# Altium project Project.PrjPcb
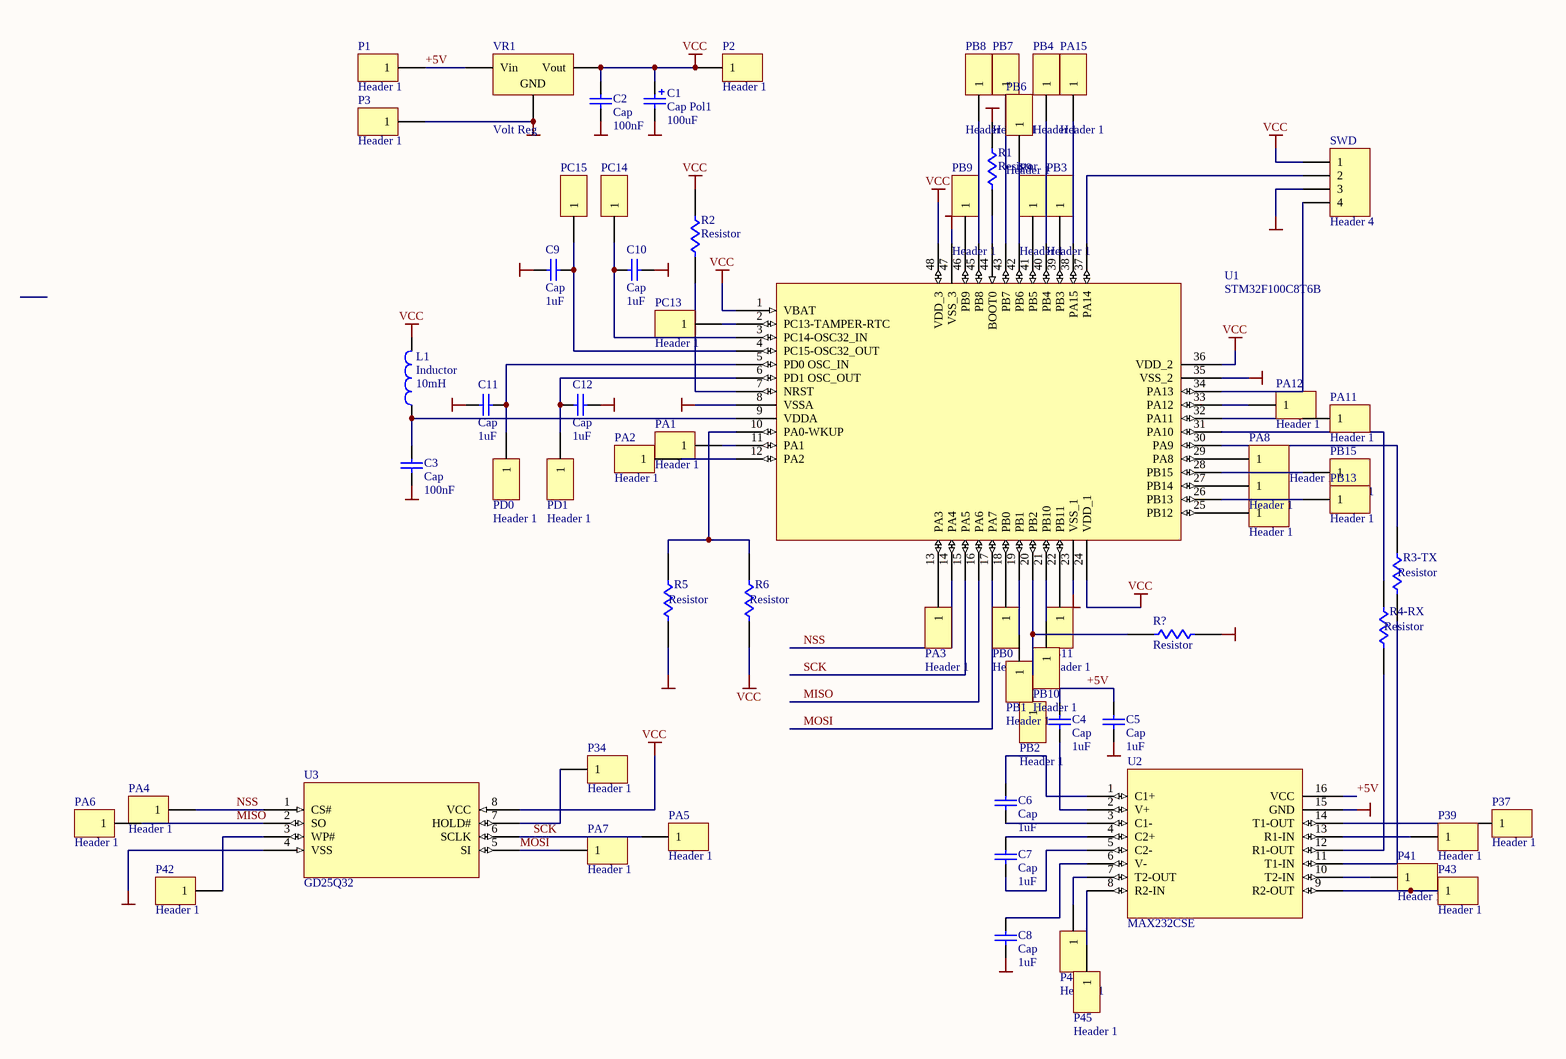
[diagram p0: Sheet1.SchDoc]
1 sheet, 68 parts. Net scope: global (net labels, ports and power ports of the same name join across sheets).
Board file: PCB1.PcbDoc

## Sheet Sheet1.SchDoc
size A3; PageSetup: Record=PageOptions|CenterHorizontal=True|CenterVertical=True|PrintScale=1.00|XCorrection=1.00|YCorrection=1.00|PrintKind=1|BorderSize=5000000|LeftOffset=0|BottomOffset=0|Orientation=2|PaperLength=1000|PaperWidth=1000|Scale=100|PaperSource=7|PrintQuality=-4|MediaType=1|DitherType=10|PaperKind=A2 420 x 594 мм|PrintScaleMode=1

### Parts
C1  Cap Pol1  value 100uF  [RAD-0.3]
C2  Cap  value 100nF  [6-0805_M]
C3  Cap  value 100nF  [6-0805_M]
C4  Cap  value 1uF  [6-0805_M]
C5  Cap  value 1uF  [6-0805_M]
C6  Cap  value 1uF  [6-0805_M]
C7  Cap  value 1uF  [6-0805_M]
C8  Cap  value 1uF  [6-0805_M]
C9  Cap  value 1uF  [6-0805_M]
C10  Cap  value 1uF  [6-0805_M]
C11  Cap  value 1uF  [6-0805_M]
C12  Cap  value 1uF  [6-0805_M]
L1  Inductor  value 10mH  [INDC4532]
P1  Header 1  [PIN1-SMALL]
P2  Header 1  [PIN1-SMALL]
P3  Header 1  [PIN1-SMALL]
P9  Header 1  [PIN1-SMALL]
P34  Header 1  [PIN1-SMALL]
P37  Header 1  [PIN1-SMALL]
P39  Header 1  [PIN1-SMALL]
P41  Header 1  [PIN1-SMALL]
P42  Header 1  [PIN1-SMALL]
P43  Header 1  [PIN1-SMALL]
P44  Header 1  [PIN1-SMALL]
P45  Header 1  [PIN1-SMALL]
PA1  Header 1  [PIN1-SMALL]
PA2  Header 1  [PIN1-SMALL]
PA3  Header 1  [PIN1-SMALL]
PA4  Header 1  [PIN1-SMALL]
PA5  Header 1  [PIN1-SMALL]
PA6  Header 1  [PIN1-SMALL]
PA7  Header 1  [PIN1-SMALL]
PA8  Header 1  [PIN1-SMALL]
PA11  Header 1  [PIN1-SMALL]
PA12  Header 1  [PIN1-SMALL]
PA15  Header 1  [PIN1-SMALL]
PB0  Header 1  [PIN1-SMALL]
PB1  Header 1  [PIN1-SMALL]
PB2  Header 1  [PIN1-SMALL]
PB3  Header 1  [PIN1-SMALL]
PB4  Header 1  [PIN1-SMALL]
PB6  Header 1  [PIN1-SMALL]
PB7  Header 1  [PIN1-SMALL]
PB8  Header 1  [PIN1-SMALL]
PB9  Header 1  [PIN1-SMALL]
PB10  Header 1  [PIN1-SMALL]
PB11  Header 1  [PIN1-SMALL]
PB12  Header 1  [PIN1-SMALL]
PB13  Header 1  [PIN1-SMALL]
PB14  Header 1  [PIN1-SMALL]
PB15  Header 1  [PIN1-SMALL]
PC13  Header 1  [PIN1-SMALL]
PC14  Header 1  [PIN1-SMALL]  (value not drawn)
PC15  Header 1  [PIN1-SMALL]  (value not drawn)
PD0  Header 1  [PIN1-SMALL]
PD1  Header 1  [PIN1-SMALL]
R1  Resistor  [6-0805_M]
R2  Resistor  [6-0805_M]
R3-TX  Resistor  [6-0805_M]
R4-RX  Resistor  [6-0805_M]
R5  Resistor  [6-0805_M]
R6  Resistor  [6-0805_M]
R?  Resistor  [6-0805_M]
SWD  Header 4  [HDR1X4]
U1  STM32F100C8T6B  [TQFP48_L]
U2  MAX232CSE  [NSO16_N]
U3  GD25Q32  [SO8_M]
VR1  Volt Reg  [DPAK]

### Nets
GND: C1.2 C2.1 C3.1 C5.1 C8.1 C9.2 C10.1 C11.2 C12.1 P3.1 R1.1 R5.2 R?.2 SWD.3 U1.8(VSSA) U1.23(VSS_1) U1.35(VSS_2) U1.47(VSS_3) U2.15(GND) U3.4(VSS) VR1.2(GND)
VCC: C1.1 C2.2 L1.2 P2.1 R2.1 R6.2 SWD.1 U1.1(VBAT) U1.24(VDD_1) U1.36(VDD_2) U1.48(VDD_3) U3.8(VCC) VR1.3(Vout)
+5V: C4.2 C5.2 P1.1 U2.16(VCC) VR1.1(Vin)
MISO: PA6.1 U1.16(PA6) U3.2(SO)
MOSI: PA7.1 U1.17(PA7) U3.5(SI)
NSS: PA4.1 U1.14(PA4) U3.1(CS#)
SCK: PA5.1 U1.15(PA5) U3.6(SCLK)
NetC3_2: C3.2 L1.1 U1.9(VDDA)
NetC4_1: C4.1 U2.2(V+)
NetC6_1: C6.1 U2.3(C1-)
NetC6_2: C6.2 U2.1(C1+)
NetC7_1: C7.1 U2.5(C2-)
NetC7_2: C7.2 U2.4(C2+)
NetC8_2: C8.2 U2.6(V-)
NetC9_1: C9.1 PC15.1 U1.4(PC15-OSC32_OUT)
NetC10_2: C10.2 PC14.1 U1.3(PC14-OSC32_IN)
NetC11_1: C11.1 PD0.1 U1.5(PD0_OSC_IN)
NetC12_2: C12.2 PD1.1 U1.6(PD1_OSC_OUT)
NetP9_1: P9.1 U1.41(PB5)
NetP34_1: P34.1 U3.7(HOLD#)
NetP37_1: P37.1 U2.14(T1-OUT)
NetP39_1: P39.1 U2.13(R1-IN)
NetP41_1: P41.1 U2.10(T2-IN)
NetP42_1: P42.1 U3.3(WP#)
NetP43_1: P43.1 U2.9(R2-OUT)
NetP44_1: P44.1 U2.7(T2-OUT)
NetP45_1: P45.1 U2.8(R2-IN)
NetPA1_1: PA1.1 U1.11(PA1)
NetPA2_1: PA2.1 U1.12(PA2)
NetPA3_1: PA3.1 U1.13(PA3)
NetPA8_1: PA8.1 U1.29(PA8)
NetPA11_1: PA11.1 U1.32(PA11)
NetPA12_1: PA12.1 U1.33(PA12)
NetPA15_1: PA15.1 U1.38(PA15)
NetPB0_1: PB0.1 U1.18(PB0)
NetPB1_1: PB1.1 U1.19(PB1)
NetPB2_1: PB2.1 R?.1 U1.20(PB2)
NetPB3_1: PB3.1 U1.39(PB3)
NetPB4_1: PB4.1 U1.40(PB4)
NetPB6_1: PB6.1 U1.42(PB6)
NetPB7_1: PB7.1 U1.43(PB7)
NetPB8_1: PB8.1 U1.45(PB8)
NetPB9_1: PB9.1 U1.46(PB9)
NetPB10_1: PB10.1 U1.21(PB10)
NetPB11_1: PB11.1 U1.22(PB11)
NetPB12_1: PB12.1 U1.25(PB12)
NetPB13_1: PB13.1 U1.26(PB13)
NetPB14_1: PB14.1 U1.27(PB14)
NetPB15_1: PB15.1 U1.28(PB15)
NetPC13_1: PC13.1 U1.2(PC13-TAMPER-RTC)
NetR1_2: R1.2 U1.44(BOOT0)
NetR2_2: R2.2 U1.7(NRST)
NetR3-TX_1: R3-TX.1 U1.30(PA9)
NetR3-TX_2: R3-TX.2 U2.11(T1-IN)
NetR4-RX_1: R4-RX.1 U1.31(PA10)
NetR4-RX_2: R4-RX.2 U2.12(R1-OUT)
NetR5_1: R5.1 R6.1 U1.10(PA0-WKUP)
NetSWD_2: SWD.2 U1.37(PA14)
NetSWD_4: SWD.4 U1.34(PA13)

### Library data of the parts
C1 = Cap Pol1: Polarized Capacitor (Radial); Published: 8-Jun-2000; LatestRevisionDate: 17-Jul-2002; LatestRevisionNote: Re-released for DXP Platform.; PackageReference: RB7.6-15; Publisher: Altium Limited; PackageDescription: Polarized Capacitor (Radial); 2 Leads
C2-C12 = Cap: Capacitor; Published: 8-Jun-2000; LatestRevisionDate: 17-Jul-2002; LatestRevisionNote: Re-released for DXP Platform.; PackageReference: RAD-0.3; Publisher: Altium Limited; PackageDescription: Radial Cap, Thru-Hole; 2 Leads; 0.3 in Pin Spacing
L1 = Inductor: Code_IEC: 1005; Published: 8-Jun-2000; LatestRevisionDate: 29-May-2009; LatestRevisionNote: IPC-7351 Footprint Added.; PackageReference: 0402-A; Publisher: Altium Limited; PackageDescription: Chip Inductor; Code_JEITA: 0402
P1-P3 P9 P34 P37 P39 P41-P45 PA1-PA8 PA11 PA12 PA15 PB0-PB4 PB6-PB15 PC13-PC15 PD0 PD1 = Header 1: Header, 1Pin; LatestRevisionDate: 17-Jul-2002; LatestRevisionNote: Re-released for DXP Platform.; Publisher: Altium Limited
SWD = Header 4: Header, 4-Pin; LatestRevisionDate: 17-Jul-2002; LatestRevisionNote: Re-released for DXP Platform.; Publisher: Altium Limited
U1 = STM32F100C8T6B: STM32 ARM-based 32-bit MCU with 32 Kbytes Flash, 48-pin LQFP, Industrial Temperature; Published: 30-May-2008; DatasheetVersion: rev6, Mar-2008; PackageVersion: Mar-2008; PackageReference: LQFP48; Publisher: Altium Limited; PackageDescription: 48-Pin Low-Profile Quad Flat Pack, 7 x 7 mm Body, 0.5 mm Pitch (LQFP48); ComponentLink1Description: Manufacturer Link; ComponentLink1URL: www.st.com/stm32; ComponentLink2Description: Datasheet; ComponentLink2URL: http://www.st.com/stonline/products/literature/ds/13586.pdf
U2 = MAX232CSE: STM32 ARM-based 32-bit MCU with 16 Kbytes Flash, 20-pin; Published: 30-May-2008; DatasheetVersion: rev6, Mar-2008; PackageVersion: Mar-2008; PackageReference: LQFP48; Publisher: Altium Limited; PackageDescription: 48-Pin Low-Profile Quad Flat Pack, 7 x 7 mm Body, 0.5 mm Pitch (LQFP48); ComponentLink1Description: Manufacturer Link; ComponentLink1URL: www.st.com/stm32; ComponentLink2Description: Datasheet; ComponentLink2URL: http://www.st.com/stonline/products/literature/ds/13586.pdf
U3 = GD25Q32: STM32 ARM-based 32-bit MCU with 16 Kbytes Flash, 20-pin; Published: 30-May-2008; DatasheetVersion: rev6, Mar-2008; PackageVersion: Mar-2008; PackageReference: LQFP48; Publisher: Altium Limited; PackageDescription: 48-Pin Low-Profile Quad Flat Pack, 7 x 7 mm Body, 0.5 mm Pitch (LQFP48); ComponentLink1Description: Manufacturer Link; ComponentLink1URL: www.st.com/stm32; ComponentLink2Description: Datasheet; ComponentLink2URL: http://www.st.com/stonline/products/literature/ds/13586.pdf
VR1 = Volt Reg: Voltage Regulator; Published: 24-Mar-1999; LatestRevisionDate: 29-May-2009; LatestRevisionNote: IPC-7351 Footprint Added.; PackageReference: D2PAK; Publisher: Altium Limited; PackageDescription: 3-Pin Transistor Outline Package 2.54 mm Pitch, 15.1 mm Lead Span
R1 R2 R3-TX R4-RX R5 R6 R? = Resistor: Published: 24-Mar-1999; LatestRevisionDate: 29-May-2009; LatestRevisionNote: IPC-7351 Footprint Added.; PackageVersion: Mar-2003; PackageReference: 6-0805; Publisher: Altium Limited; PackageDescription: Chip Resistor 0805 Case Size; Code_IPC: RESC2012